# Altium project DMD_Card.PrjPcb
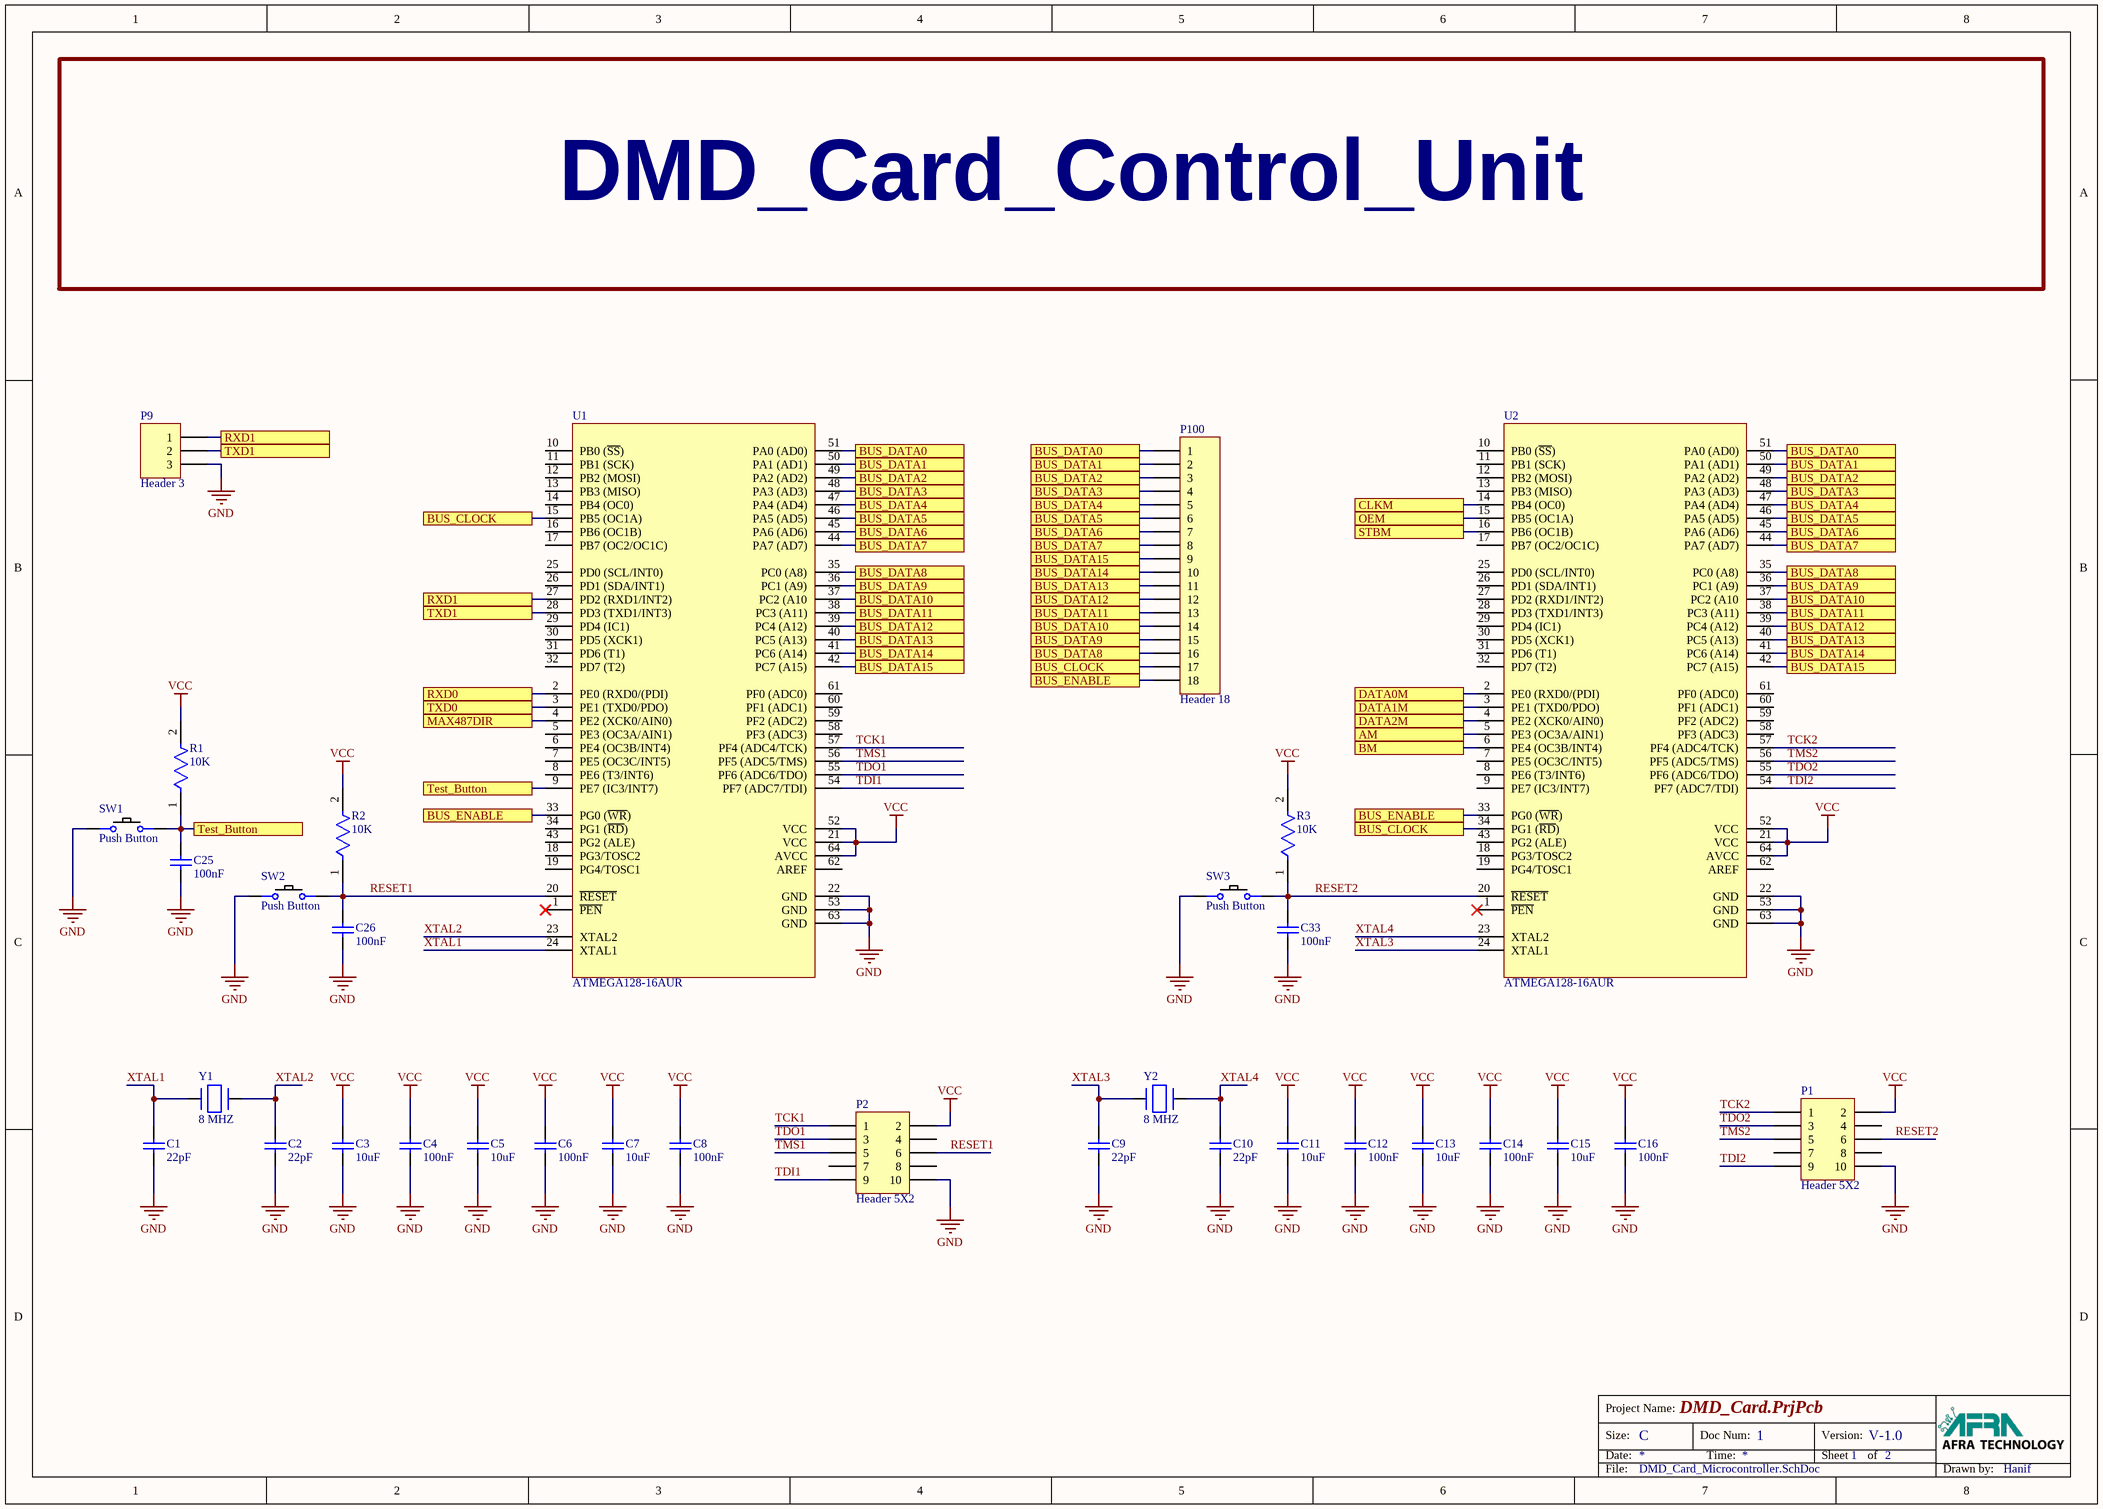
[diagram p0: DMD_Card_Microcontroller.SchDoc]
Project_Version: V-1.0
2 sheets, 64 parts. Net scope: flat (ports and power ports of the same name join across sheets).
Board file: DMD_Card.PcbDoc
Sheets:
  DMD_Card_Microcontroller.SchDoc
  DMD_Card_Modules.SchDoc

## Sheet DMD_Card_Microcontroller.SchDoc
size A3; DrawnBy: Hanif; Organization: AFRA Technology; DocumentNumber: 1; SheetNumber: 1; SheetTotal: 2

### Parts
C1  22pF  [Yageo_CC1206-1.25_IPC_A]
C2  22pF  [Yageo_CC1206-1.25_IPC_A]
C3  10uF  [Yageo_CC1206-1.25_IPC_A]
C4  100nF  [Yageo_CC1206-1.25_IPC_A]
C5  10uF  [Yageo_CC1206-1.25_IPC_A]
C6  100nF  [Yageo_CC1206-1.25_IPC_A]
C7  10uF  [Yageo_CC1206-1.25_IPC_A]
C8  100nF  [Yageo_CC1206-1.25_IPC_A]
C9  22pF  [Yageo_CC1206-1.25_IPC_A]
C10  22pF  [Yageo_CC1206-1.25_IPC_A]
C11  10uF  [Yageo_CC1206-1.25_IPC_A]
C12  100nF  [Yageo_CC1206-1.25_IPC_A]
C13  10uF  [Yageo_CC1206-1.25_IPC_A]
C14  100nF  [Yageo_CC1206-1.25_IPC_A]
C15  10uF  [Yageo_CC1206-1.25_IPC_A]
C16  100nF  [Yageo_CC1206-1.25_IPC_A]
C25  100nF  [Yageo_CC1206-1.25_IPC_A]
C26  100nF  [Yageo_CC1206-1.25_IPC_A]
C33  100nF  [Yageo_CC1206-1.25_IPC_A]
P1  Header 5X2  [HDR2X5]
P2  Header 5X2  [HDR2X5]
P9  Header 3  [HDR1X3]
P100  Header 18  [HDR1X18]
R1  10K  [Yageo_RT1206_IPC_A]
R2  10K  [Yageo_RT1206_IPC_A]
R3  10K  [Yageo_RT1206_IPC_A]
SW1  Push Button  [Tactile Switch SPST]
SW2  Push Button  [Tactile Switch SPST]
SW3  Push Button  [Tactile Switch SPST]
U1  ATMEGA128-16AUR  [64-TQFP]
U2  ATMEGA128-16AUR  [64-TQFP]
Y1  8 MHZ  [CTS_ATS080B_0]
Y2  8 MHZ  [CTS_ATS080B_0]

### Ports
AM, BM, BUS_CLOCK, BUS_DATA0, BUS_DATA1, BUS_DATA2, BUS_DATA3, BUS_DATA4, BUS_DATA5, BUS_DATA6, BUS_DATA7, BUS_DATA8, BUS_DATA9, BUS_DATA10, BUS_DATA11, BUS_DATA12, BUS_DATA13, BUS_DATA14, BUS_DATA15, BUS_ENABLE, CLKM, DATA0M, DATA1M, DATA2M, MAX487DIR, OEM, RXD0, RXD1, STBM, Test_Button, TXD0, TXD1

### Nets
GND: C1.1 C2.1 C3.1 C4.1 C5.1 C6.1 C7.1 C8.1 C9.1 C10.1 C11.1 C12.1 C13.1 C14.1 C15.1 C16.1 C25.1 C26.1 C33.1 P1.10 P2.10 P9.3 SW1.1,2 SW2.1,2 SW3.1,2 U1.22(GND) U1.53(GND) U1.63(GND) U2.22(GND) U2.53(GND) U2.63(GND)
VCC: C3.2 C4.2 C5.2 C6.2 C7.2 C8.2 C11.2 C12.2 C13.2 C14.2 C15.2 C16.2 P1.2 P2.2 R1.2 R2.2 R3.2 U1.21(VCC) U1.52(VCC) U1.64(AVCC) U2.21(VCC) U2.52(VCC) U2.64(AVCC)
RESET1: C26.2 P2.6 R2.1 SW2.3,4 U1.20(~{RESET})
RESET2: C33.2 P1.6 R3.1 SW3.3,4 U2.20(~{RESET})
TCK1: P2.1 U1.57(PF4_(ADC4/TCK))
TCK2: P1.1 U2.57(PF4_(ADC4/TCK))
TDI1: P2.9 U1.54(PF7_(ADC7/TDI))
TDI2: P1.9 U2.54(PF7_(ADC7/TDI))
TDO1: P2.3 U1.55(PF6_(ADC6/TDO))
TDO2: P1.3 U2.55(PF6_(ADC6/TDO))
TMS1: P2.5 U1.56(PF5_(ADC5/TMS))
TMS2: P1.5 U2.56(PF5_(ADC5/TMS))
XTAL1: C1.2 U1.24(XTAL1) Y1.1
XTAL2: C2.2 U1.23(XTAL2) Y1.2
XTAL3: C9.2 U2.24(XTAL1) Y2.1
XTAL4: C10.2 U2.23(XTAL2) Y2.2
NetC25_2: C25.2 R1.1 SW1.3,4 U1.9(PE7_(IC3/INT7)) ; port Test_Button
NetP9_1: P9.1 U1.27(PD2_(RXD1/INT2)) ; port RXD1
NetP9_2: P9.2 U1.28(PD3_(TXD1/INT3)) ; port TXD1
NetP100_1: P100.1 U1.51(PA0_(AD0)) U2.51(PA0_(AD0)) ; port BUS_DATA0
NetP100_2: P100.2 U1.50(PA1_(AD1)) U2.50(PA1_(AD1)) ; port BUS_DATA1
NetP100_3: P100.3 U1.49(PA2_(AD2)) U2.49(PA2_(AD2)) ; port BUS_DATA2
NetP100_4: P100.4 U1.48(PA3_(AD3)) U2.48(PA3_(AD3)) ; port BUS_DATA3
NetP100_5: P100.5 U1.47(PA4_(AD4)) U2.47(PA4_(AD4)) ; port BUS_DATA4
NetP100_6: P100.6 U1.46(PA5_(AD5)) U2.46(PA5_(AD5)) ; port BUS_DATA5
NetP100_7: P100.7 U1.45(PA6_(AD6)) U2.45(PA6_(AD6)) ; port BUS_DATA6
NetP100_8: P100.8 U1.44(PA7_(AD7)) U2.44(PA7_(AD7)) ; port BUS_DATA7
NetP100_9: P100.9 U1.42(PC7_(A15)) U2.42(PC7_(A15)) ; port BUS_DATA15
NetP100_10: P100.10 U1.41(PC6_(A14)) U2.41(PC6_(A14)) ; port BUS_DATA14
NetP100_11: P100.11 U1.40(PC5_(A13)) U2.40(PC5_(A13)) ; port BUS_DATA13
NetP100_12: P100.12 U1.39(PC4_(A12)) U2.39(PC4_(A12)) ; port BUS_DATA12
NetP100_13: P100.13 U1.38(PC3_(A11)) U2.38(PC3_(A11)) ; port BUS_DATA11
NetP100_14: P100.14 U1.37(PC2_(A10) U2.37(PC2_(A10) ; port BUS_DATA10
NetP100_15: P100.15 U1.36(PC1_(A9)) U2.36(PC1_(A9)) ; port BUS_DATA9
NetP100_16: P100.16 U1.35(PC0_(A8)) U2.35(PC0_(A8)) ; port BUS_DATA8
NetP100_17: P100.17 U1.15(PB5_(OC1A)) U2.34(PG1_(~{RD})) ; port BUS_CLOCK
NetP100_18: P100.18 U1.33(PG0_(~{WR})) U2.33(PG0_(~{WR})) ; port BUS_ENABLE
NetU1_2: U1.2(PE0_(RXD0/(PDI)) ; port RXD0
NetU1_3: U1.3(PE1_(TXD0/PDO)) ; port TXD0
NetU1_4: U1.4(PE2_(XCK0/AIN0)) ; port MAX487DIR
NetU2_2: U2.2(PE0_(RXD0/(PDI)) ; port DATA0M
NetU2_3: U2.3(PE1_(TXD0/PDO)) ; port DATA1M
NetU2_4: U2.4(PE2_(XCK0/AIN0)) ; port DATA2M
NetU2_5: U2.5(PE3_(OC3A/AIN1)) ; port AM
NetU2_6: U2.6(PE4_(OC3B/INT4)) ; port BM
NetU2_14: U2.14(PB4_(OC0)) ; port CLKM
NetU2_15: U2.15(PB5_(OC1A)) ; port OEM
NetU2_16: U2.16(PB6_(OC1B)) ; port STBM

Not connected (* = marked no-connect by the designer): P1 4 7 8; P2 4 7 8; U1 1(~{PEN})* 5(PE3_(OC3A/AIN1)) 6(PE4_(OC3B/INT4)) 7(PE5_(OC3C/INT5)) 8(PE6_(T3/INT6)) 10(PB0_(~{SS})) 11(PB1_(SCK)) 12(PB2_(MOSI)) 13(PB3_(MISO)) 14(PB4_(OC0)) 16(PB6_(OC1B)) 17(PB7_(OC2/OC1C)) 18(PG3/TOSC2) 19(PG4/TOSC1) 25(PD0_(SCL/INT0)) 26(PD1_(SDA/INT1)) 29(PD4_(IC1)) 30(PD5_(XCK1)) 31(PD6_(T1)) 32(PD7_(T2)) 34(PG1_(~{RD})) 43(PG2_(ALE)) 58(PF3_(ADC3)) 59(PF2_(ADC2)) 60(PF1_(ADC1)) 61(PF0_(ADC0)) 62(AREF); U2 1(~{PEN})* 7(PE5_(OC3C/INT5)) 8(PE6_(T3/INT6)) 9(PE7_(IC3/INT7)) 10(PB0_(~{SS})) 11(PB1_(SCK)) 12(PB2_(MOSI)) 13(PB3_(MISO)) 17(PB7_(OC2/OC1C)) 18(PG3/TOSC2) 19(PG4/TOSC1) 25(PD0_(SCL/INT0)) 26(PD1_(SDA/INT1)) 27(PD2_(RXD1/INT2)) 28(PD3_(TXD1/INT3)) 29(PD4_(IC1)) 30(PD5_(XCK1)) 31(PD6_(T1)) 32(PD7_(T2)) 43(PG2_(ALE)) 58(PF3_(ADC3)) 59(PF2_(ADC2)) 60(PF1_(ADC1)) 61(PF0_(ADC0)) 62(AREF)

### Notes on the sheet
- DMD_Card_Control_Unit
- Project Name:
- Size:
- Date:
- C
- Doc Num:
- Time:
- Version:
- Sheet
- of
- File:
- Drawn by:

### Library data of the parts
C1 C2 C9 C10 = CC1206JRNP09BN220: CAP 22pF 50V ±5% 1206 (3216 Metric) Thickness 0.75mm SMD; Tolerance: Â±5%; Case-Metric: 3216; Case-EIA: 1206; Max Thickness: 0.75 mm; Rated Voltage: 50 V; Value: 22pF; Technology: SMT; PartNumber: CC1206JRNP09BN220
C3 C5 C7 C11 C13 C15 = CC1206KRX7R7BB334
C4 C6 C8 C12 C14 C16 C25 C26 C33 = CC1206KRX7R7BB104
P1 P2 = Header 5X2: Header, 5-Pin, Dual row; LatestRevisionDate: 17-Jul-2002; LatestRevisionNote: Re-released for DXP Platform.; Publisher: Altium Limited
P9 = Header 3: Header, 3-Pin; LatestRevisionDate: 17-Jul-2002; LatestRevisionNote: Re-released for DXP Platform.; Publisher: Altium Limited
P100 = Header 18: Header, 18-Pin; LatestRevisionDate: 17-Jul-2002; LatestRevisionNote: Re-released for DXP Platform.; Publisher: Altium Limited
R1-R3 = RT1206BRD0710KL
SW1-SW3 = PTS526SKG15SMTR2LFS: Switch Tactile N.O. SPST Round Button Gull Wing 0.05A 12VDC 200000Cycles 2.45N SMD T/R; Manufacturer: ITT C&K; Supplier 1: Digi-Key; Manufacturer Part Number: PTS526SKG15SMTR2LFS; RoHS: No; Category: Tactile Switches; Stock 1: 7554; Pricing 1: 1=0.13000, 10=0.12100, 25=0.11480, 100=0.10430, 250=0.09808, 500=0.08972, 1000=0.07511 (USD); Supplier Part Number 1: CKN12223-1-ND
U1 U2 = ATMEGA128-16AUR: 8-bit AVR Microcontroller, 4.5-5.5V, 128KB Flash, 4KB EEPROM, 4KB SRAM, 64-pin TQFP, Industrial Grade (-40°C to 85°C), Reel; ComponentLink1Description: Manufacturer URL; ComponentLink2Description: ATmega128(L) Datasheet; DatasheetVersion: revX, Jun-2011; ComponentLink3URL: http://www.atmel.com/dyn/resources/prod_documents/2467S.pdf; ComponentLink3Description: ATmega128(L) Summary; ComponentLink1URL: http://www.atmel.com/; Code_JEDEC: MS-026-AEB; PackageVersion: revC, Oct-2010; PackageDescription: 64-Pin Plastic Thin Profile Quad Flat Pack, 14 x 14 x 1.0 mm Body, 0.8 mm Pitch (TQFP); ComponentLink2URL: http://www.atmel.com/dyn/resources/prod_documents/doc2467.pdf; PackageReference: 64A; PartNumber: ATMEGA128-16AUR
Y1 Y2 = CRYSTAL 8.000MHZ: CRYSTAL 8.000MHZ 20PF THRU; Manufacturer: TXC; Manufacturer Part Number: 9B-8.000MBBK-B; Frequency Stability: 50ppm; Frequency: 8MHz; ESR (Equivalent Series Resistance): 80R; Supplier 1: Digi-Key; RoHS: Yes; Category: Crystals; Pricing 1: 1000=0.16000 (USD); Mount: Through Hole; Case/Package: Metal; Min Operating Temperature: -20°C; Max Operating Temperature: 70°C; Package Quantity: 1000; Frequency Tolerance: 50ppm; Load Capacitance: 20pF; Packaging: Bulk; Length: 0.453inch; Width: 0.197inch; Height: 0.145inch; ComponentLink1URL: https://datasheet.ciiva.com/6733/9b-6733750.pdf?src-supplier=Digi-Key; ComponentLink1Description: https://datasheet.ciiva.com/6733/9b-6733750.pdf?src-supplier=Digi-Key; ComponentLink2URL: https://datasheet.ciiva.com/29631/9b-29631174.pdf?src-supplier=Digi-Key; ComponentLink2Description: https://datasheet.ciiva.com/29631/9b-29631174.pdf?src-supplier=Digi-Key; Supplier Part Number 1: 887-2033-ND

## Sheet DMD_Card_Modules.SchDoc
size A3; DrawnBy: Hanif; Organization: AFRA Technology; DocumentNumber: 2; SheetNumber: 2; SheetTotal: 2
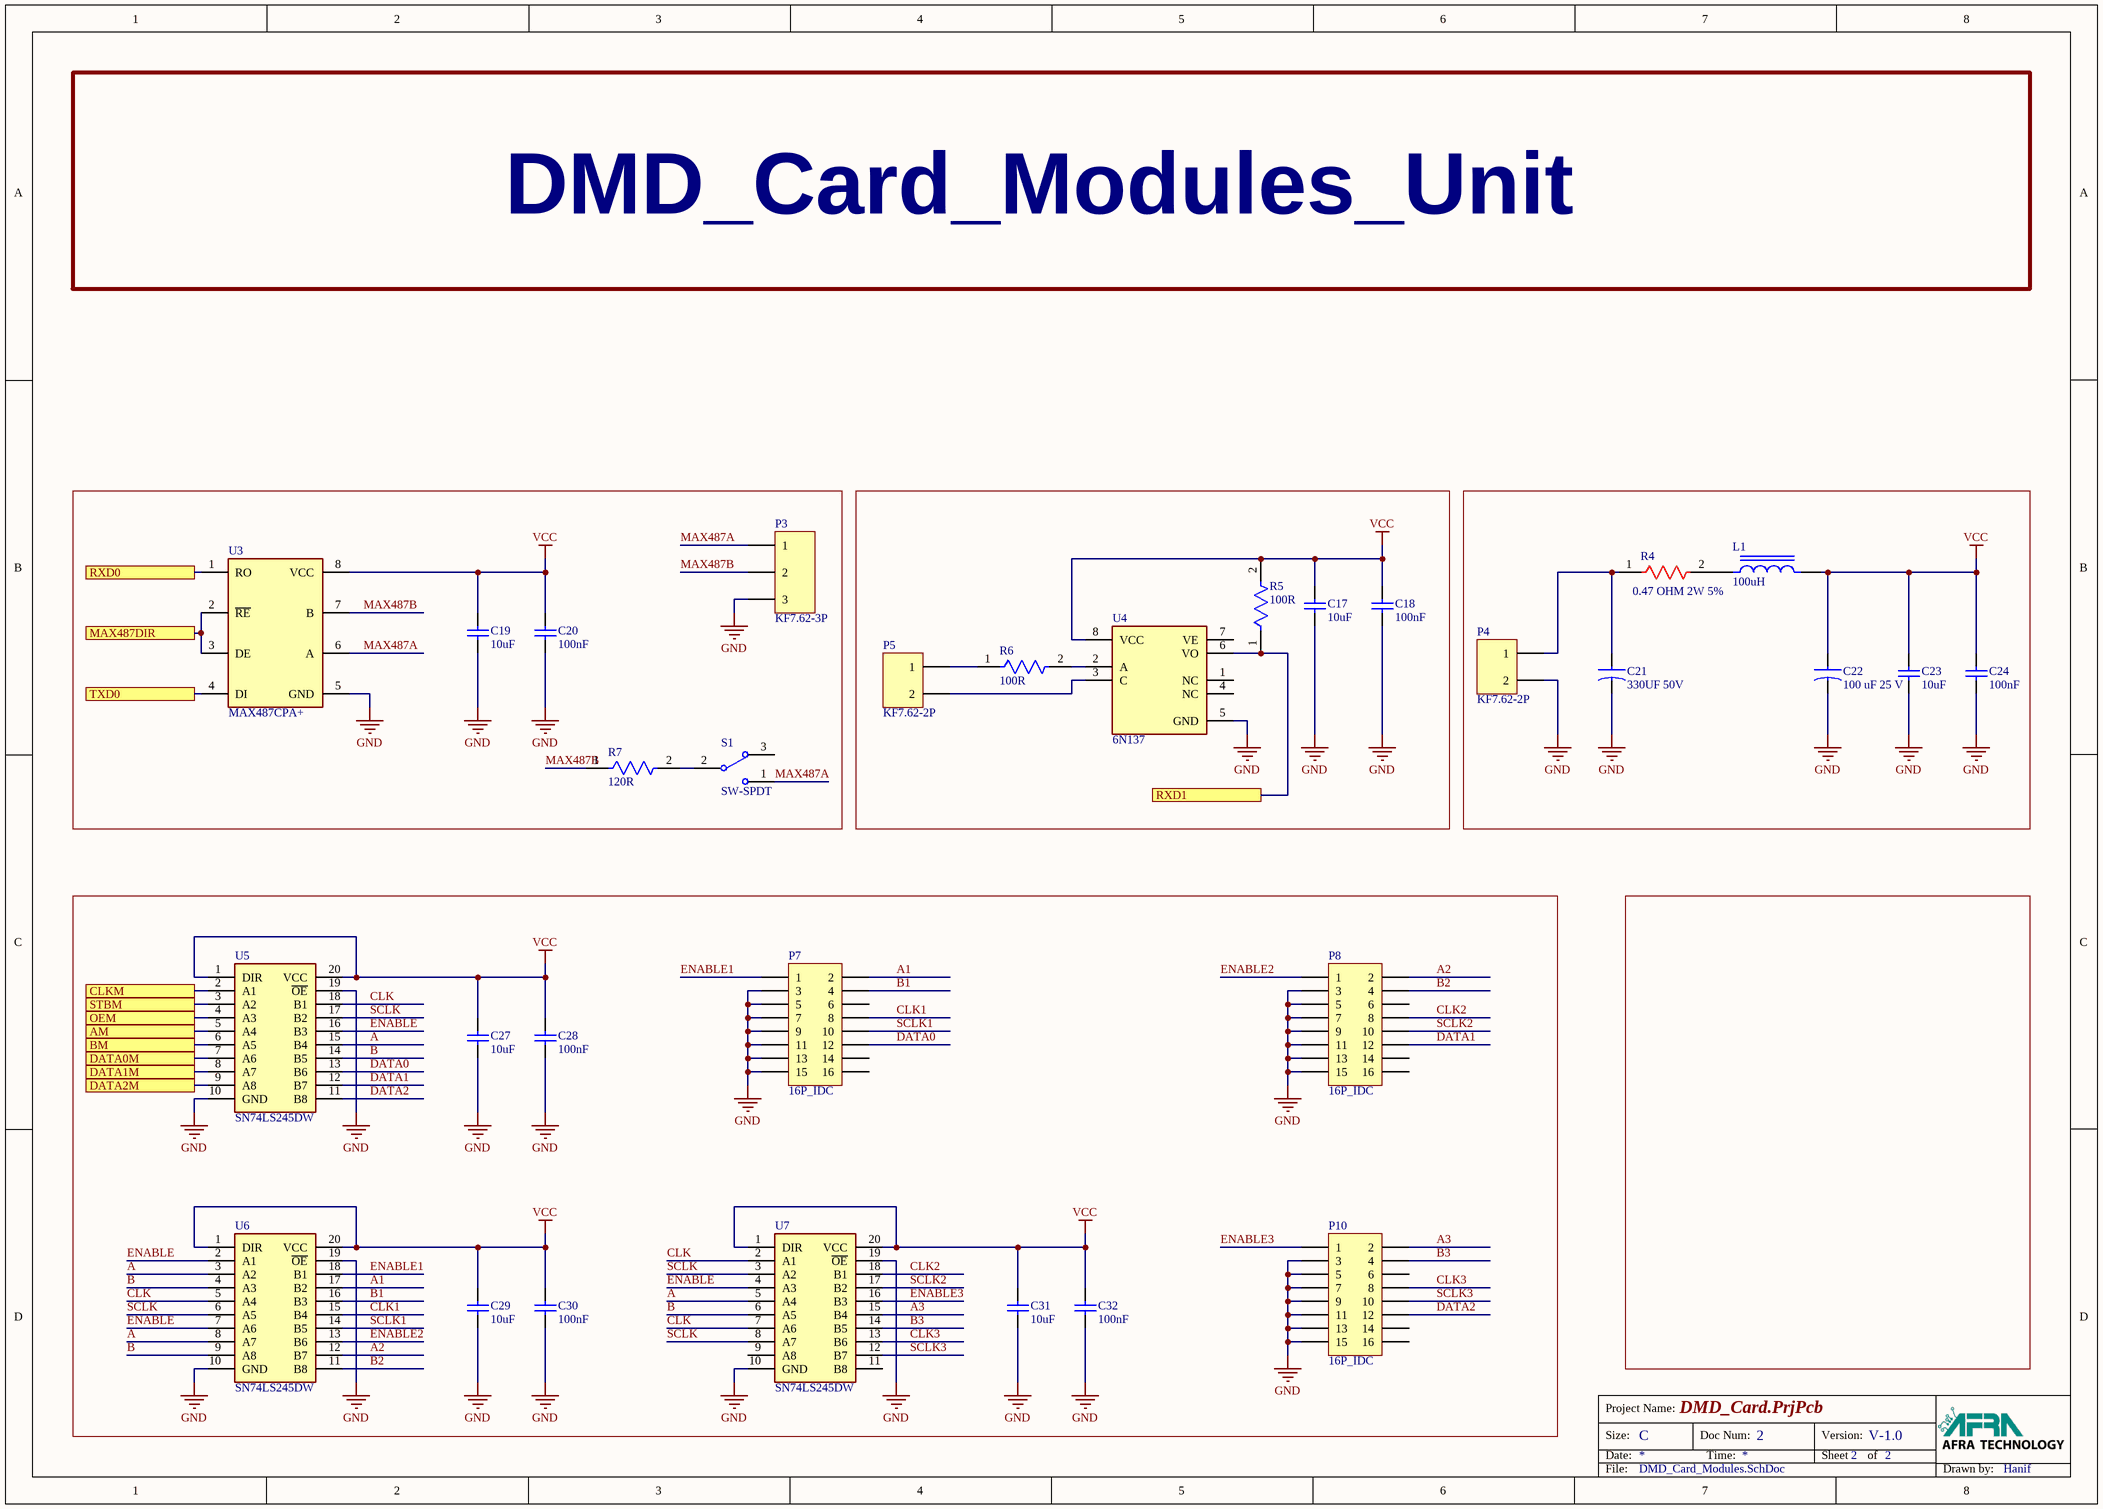
[diagram p1: DMD_Card_Modules.SchDoc]

### Parts
C17  10uF  [Yageo_CC1206-1.25_IPC_A]
C18  100nF  [Yageo_CC1206-1.25_IPC_A]
C19  10uF  [Yageo_CC1206-1.25_IPC_A]
C20  100nF  [Yageo_CC1206-1.25_IPC_A]
C21  330UF 50V  [Multy_Radial_Capacitor]
C22  100 uF 25 V  [Multy_Radial_Capacitor]
C23  10uF  [Yageo_CC1206-1.25_IPC_A]
C24  100nF  [Yageo_CC1206-1.25_IPC_A]
C27  10uF  [Yageo_CC1206-1.25_IPC_A]
C28  100nF  [Yageo_CC1206-1.25_IPC_A]
C29  10uF  [Yageo_CC1206-1.25_IPC_A]
C30  100nF  [Yageo_CC1206-1.25_IPC_A]
C31  10uF  [Yageo_CC1206-1.25_IPC_A]
C32  100nF  [Yageo_CC1206-1.25_IPC_A]
L1  100uH  [Radia_03]
P3  KF7.62-3P  [KF7.62-3P Barrier Terminal Block]
P4  KF7.62-2P  [KF7.62-2P Barrier Terminal Block]
P5  KF7.62-2P  [KF7.62-2P Barrier Terminal Block]
P7  16P_IDC  [16Pin_IDC_Connector]
P8  16P_IDC  [16Pin_IDC_Connector]
P10  16P_IDC  [16Pin_IDC_Connector]
R4  0.47 OHM 2W 5%  [Axial 0.6]
R5  100R  [Yageo_RT1206_IPC_A]
R6  100R  [Yageo_RT1206_IPC_A]
R7  120R  [AXIAL 0.4]
S1  SW-SPDT  [Toggle Switch_SPDT]
U3  MAX487CPA+  [DIP_08]
U4  Part Number: 6N137  [DIP_08]  (hidden comment: IC_Vishay_6N137_eec)
U5  SN74LS245DW  [SOIC127P1030X265-20N]
U6  SN74LS245DW  [SOIC127P1030X265-20N]
U7  SN74LS245DW  [SOIC127P1030X265-20N]

### Ports
AM, BM, CLKM, DATA0M, DATA1M, DATA2M, MAX487DIR, OEM, RXD0, RXD1, STBM, TXD0

### Nets
GND: C17.1 C18.1 C19.1 C20.1 C21.2 C22.2 C23.1 C24.1 C27.1 C28.1 C29.1 C30.1 C31.1 C32.1 P3.3 P4.2 P7.3 P7.5 P7.7 P7.9 P7.11 P7.13 P7.15 P8.3 P8.5 P8.7 P8.9 P8.11 P8.13 P8.15 P10.3 P10.5 P10.7 P10.9 P10.11 P10.13 P10.15 U3.5(GND) U4.5(GND) U5.10(GND) U5.19(~{OE}) U6.10(GND) U6.19(~{OE}) U7.10(GND) U7.19(~{OE})
VCC: C17.2 C18.2 C19.2 C20.2 C22.1 C23.2 C24.2 C27.2 C28.2 C29.2 C30.2 C31.2 C32.2 L1.2 R5.2 U3.8(VCC) U4.8(VCC) U5.1(DIR) U5.20(VCC) U6.1(DIR) U6.20(VCC) U7.1(DIR) U7.20(VCC)
A: U5.15(B4) U6.3(A2) U6.8(A7) U7.5(A4)
A1: P7.2 U6.17(B2)
A2: P8.2 U6.12(B7)
A3: P10.2 U7.15(B4)
B: U5.14(B5) U6.4(A3) U6.9(A8) U7.6(A5)
B1: P7.4 U6.16(B3)
B2: P8.4 U6.11(B8)
B3: P10.4 U7.14(B5)
CLK: U5.18(B1) U6.5(A4) U7.2(A1) U7.7(A6)
CLK1: P7.8 U6.15(B4)
CLK2: P8.8 U7.18(B1)
CLK3: P10.8 U7.13(B6)
DATA0: P7.12 U5.13(B6)
DATA1: P8.12 U5.12(B7)
DATA2: P10.12 U5.11(B8)
ENABLE: U5.16(B3) U6.2(A1) U6.7(A6) U7.4(A3)
ENABLE1: P7.1 U6.18(B1)
ENABLE2: P8.1 U6.13(B6)
ENABLE3: P10.1 U7.16(B3)
MAX487A: P3.1 S1.1 U3.6(A)
MAX487B: P3.2 R7.1 U3.7(B)
SCLK: U5.17(B2) U6.6(A5) U7.3(A2) U7.8(A7)
SCLK1: P7.10 U6.14(B5)
SCLK2: P8.10 U7.17(B2)
SCLK3: P10.10 U7.12(B7)
NetC21_1: C21.1 P4.1 R4.1
NetL1_1: L1.1 R4.2
NetP5_1: P5.1 R6.1
NetP5_2: P5.2 U4.3(C)
NetP9_1: R5.1 U4.6(VO) ; port RXD1
NetR6_2: R6.2 U4.2(A)
NetR7_2: R7.2 S1.2
NetU1_2: U3.1(RO) ; port RXD0
NetU1_3: U3.4(DI) ; port TXD0
NetU1_4: U3.2(~{RE}) U3.3(DE) ; port MAX487DIR
NetU2_2: U5.7(A6) ; port DATA0M
NetU2_3: U5.8(A7) ; port DATA1M
NetU2_4: U5.9(A8) ; port DATA2M
NetU2_5: U5.5(A4) ; port AM
NetU2_6: U5.6(A5) ; port BM
NetU2_14: U5.2(A1) ; port CLKM
NetU2_15: U5.4(A3) ; port OEM
NetU2_16: U5.3(A2) ; port STBM

Not connected (* = marked no-connect by the designer): P7 6 14 16; P8 6 14 16; P10 6 14 16; S1 3; U4 1(NC) 4(NC) 7(VE); U7 9(A8) 11(B8)

### Notes on the sheet
- DMD_Card_Modules_Unit
- Project Name:
- Size:
- Date:
- C
- Doc Num:
- Time:
- Version:
- Sheet
- of
- File:
- Drawn by:

### Library data of the parts
C17 C19 C23 C27 C29 C31 = CC1206KRX7R7BB334
C18 C20 C24 C28 C30 C32 = CC1206KRX7R7BB104
C21 = 330 uF 50 V Electrolytic Capacitors: Aluminum Electrolytic Capacitors Radial, Can - 10000 Hrs @ 105°C; Manufacturer: Rubycon; Manufacturer Part Number: 50YXJ330M10X20; Tolerance: 20%; Ripple Current: 1.22A; Impedance: 60mR; Life (Hours): 10000Hour; Supplier 1: Digi-Key; RoHS: Yes; Category: Aluminum Electrolytic Capacitors; Stock 1: 72; Pricing 1: 1=0.82000, 10=0.57600, 50=0.43560, 100=0.37940, 500=0.28106, 1000=0.23890, 2500=0.22485, 5000=0.21080 (USD); Mount: Through Hole; Case/Package: Radial; Min Operating Temperature: -40°C; Max Operating Temperature: 105°C; Capacitance: 330uF; Termination: Radial; Package Quantity: 1000; Voltage Rating: 50V; Packaging: Bulk; Voltage Rating (DC): 50V; Series: YXJ; Diameter: 10mm; Height: 20mm; Lead Pitch: 5mm; Height - Seated (Max): 0.866inch; Radiation Hardening: No; REACH SVHC: No SVHC; RoHS Compliant: Yes; ComponentLink1URL: https://datasheet.ciiva.com/46371/1657883-46371898.pdf?src-supplier=Element14; ComponentLink1Description: https://datasheet.ciiva.com/46371/1657883-46371898.pdf?src-supplier=Element14; ComponentLink2URL: https://datasheet.ciiva.com/17513/e-yxj-17513675.pdf?src-supplier=Avnet+Europe; ComponentLink2Description: https://datasheet.ciiva.com/17513/e-yxj-17513675.pdf?src-supplier=Avnet+Europe; Supplier Part Number 1: 1189-1424-ND
C22 = 100 uF 25 V Electrolytic Capacitor: RZ Series Radial 25 V 100 uF Ø 6.3 x 11 mm 105 °C Electrolytic Capacitor; Manufacturer: Samwha; Manufacturer Part Number: RZ1E107M6L011BB280; Capacitance: 100uF; Voltage Rating: 25V; Supplier 1: Future Electronics; RoHS: Yes; Pricing 1: 3600=0.03300 (USD); Case/Package: Radial; Lead Free: Lead Free; ComponentLink1URL: http://www.samwha.com/electric/product/list_pdf2/RZ.pdf?src-supplier=Future+Electronics; ComponentLink1Description: http://www.samwha.com/electric/product/list_pdf2/RZ.pdf?src-supplier=Future+Electronics; Supplier Part Number 1: 1048642
L1 = RLB0812-101KL: FIXED IND 100UH 320MA 600 MOHM; Manufacturer: Bourns; Core Material: Ferrite; Tolerance: 10%; Self Resonant Frequency: 4.2MHz; Shielding: Unshielded; DC Resistance (DCR): 600mR; Q Factor: 45; Test Frequency: 796kHz; Lead/Base Style: Radial; Lead Diameter: 0.65mm; Supplier 1: Digi-Key; Manufacturer Part Number: RLB0812-101KL; RoHS: Yes; Category: Fixed Inductors; Stock 1: 1145; Pricing 1: 1=0.40000, 10=0.35200, 25=0.30800, 50=0.26400, 100=0.24200, 250=0.22000, 500=0.20680, 1000=0.15840, 2500=0.14960 (USD); Mount: Through Hole; Case/Package: Radial; Min Operating Temperature: -40°C; Max Operating Temperature: 105°C; Package Quantity: 400; Packaging: Bulk; Current Rating: 320mA; Inductance: 100uH; Max DC Current: 320mA; Termination: Radial; DC Current: 320mA; Series: RLB; Diameter: 6.7mm; Length: 10mm; Height: 0.394inch; Lead Pitch: 3mm; Radiation Hardening: No; Military Standard: Not; RoHS Compliant: Yes; ComponentLink1URL: https://datasheet.ciiva.com/1069/rlb-1069242.pdf?src-supplier=Digi-Key; ComponentLink1Description: https://datasheet.ciiva.com/1069/rlb-1069242.pdf?src-supplier=Digi-Key; ComponentLink2URL: https://datasheet.ciiva.com/4960/rlb-4960710.pdf?src-supplier=Mouser; ComponentLink2Description: https://datasheet.ciiva.com/4960/rlb-4960710.pdf?src-supplier=Mouser; ComponentLink3URL: https://datasheet.ciiva.com/8110/rlb-8110999.pdf?src-supplier=Avnet; ComponentLink3Description: https://datasheet.ciiva.com/8110/rlb-8110999.pdf?src-supplier=Avnet; Supplier Part Number 1: RLB0812-101KL-ND
P3 = KF7.62-3P Barrier Terminal Block: KF7.62-3P Barrier Terminal Block, 7.62mm spacing barrier terminals with side expandable slot. The terminal accepts wire gauge of 22~12AWG. Connectors are available black PA66 material.
P4 P5 = KF7.62-2P Barrier Terminal Block: KF7.62-2P Barrier Terminal Block, 7.62mm spacing barrier terminals with side expandable slot. The terminal accepts wire gauge of 22~12AWG. Connectors are available black PA66 material.
P7 P8 P10 = BHR-16-VUA: Headers & Wire Housings 16P STRAIGHT; Manufacturer: Adam Equipment; Current Rating: 1A; Number of Positions: 16; Pitch: 2.54mm; Supplier 1: Digi-Key; Manufacturer Part Number: BHR-16-VUA; RoHS: Yes; Category: Connectors; Stock 1: 804; Pricing 1: 1=0.45000, 10=0.42400, 100=0.29690, 500=0.25452, 1000=0.21210, 5000=0.18180, 10000=0.16968 (USD); Contact Plating: Gold; Contact Material: Brass; Package Quantity: 276; Number of Rows: 2; Packaging: Tray; Orientation: Straight; Termination: IDC; Lead Free: Lead Free; ComponentLink1URL: https://datasheet.ciiva.com/16418/page-319-321-16418937.pdf?src-supplier=Future+Electronics; ComponentLink1Description: https://datasheet.ciiva.com/16418/page-319-321-16418937.pdf?src-supplier=Future+Electronics; Supplier Part Number 1: 2057-BHR-16-VUA-ND
R4 = 2WD47: RESISTOR 2 WATT METAL OXIDE FILM FLAMEPROOF 0.47 OHM 5% AXIAL LEAD; Manufacturer: NTE Electronics; Resistance: 470mR; Temperature Coefficient: 200ppm/°C; Supplier 1: Newark; Manufacturer Part Number: 2WD47; RoHS: Yes; Category: Through-Hole Resistors; Pricing 1: 1=0.18800 (USD); Mount: Through Hole; Case/Package: Metal; Weight: 0.0024lb; Min Operating Temperature: -55°C; Max Operating Temperature: 200°C; Tolerance: 5%; Power Rating: 2W; Termination: Axial; Length: 3.25inch; Width: 0.25inch; Height: 0.25inch; RoHS Compliant: No; ComponentLink1URL: http://www.onlinecomponents.com/productFiles/mf-NTE/twow.pdf?src-supplier=Onlinecomponents.com; ComponentLink1Description: http://www.onlinecomponents.com/productFiles/mf-NTE/twow.pdf?src-supplier=Onlinecomponents.com; ComponentLink2URL: http://www.alliedelec.com/m/d/d44ce2bb19ec670cc5afc3c1f91c41cf.pdf?src-supplier=Allied+Electronics; ComponentLink2Description: http://www.alliedelec.com/m/d/d44ce2bb19ec670cc5afc3c1f91c41cf.pdf?src-supplier=Allied+Electronics; Supplier Part Number 1: 33C8349
R5 R6 = RT1206BRD07100RL
R7 = 120R 1/4W: RES 120 OHM 1/4W 0.1% AXIAL; Manufacturer: Yageo; Manufacturer Part Number: MFP-25BRD52-120R; Max Power Dissipation: 250mW; Temperature Coefficient: 25ppm/°C; Supplier 1: Digi-Key; RoHS: Yes; Category: Through-Hole Resistors; Stock 1: 4420; Pricing 1: 1=0.70000, 10=0.49900, 25=0.38960, 50=0.32960, 100=0.25970, 250=0.21972, 500=0.17978, 1000=0.13983 (USD); Case/Package: Axial; Min Operating Temperature: -55°C; Max Operating Temperature: 155°C; Package Quantity: 1; Resistance: 120R; Tolerance: 0.1%; Packaging: Tape and Reel; Resistor Type: Metal Film; Number of Terminations: 2; Series: MFP; Length: 0.248inch; Lead Free: Lead Free; RoHS Compliant: Yes; ComponentLink1URL: https://datasheet.ciiva.com/2713/yageolr-mfp-2013-2713048.pdf?src-supplier=Digi-Key; ComponentLink1Description: https://datasheet.ciiva.com/2713/yageolr-mfp-2013-2713048.pdf?src-supplier=Digi-Key; ComponentLink2URL: https://datasheet.ciiva.com/2713/yageolr-mfp-2013-2713049.pdf?src-supplier=Digi-Key; ComponentLink2Description: https://datasheet.ciiva.com/2713/yageolr-mfp-2013-2713049.pdf?src-supplier=Digi-Key; Supplier Part Number 1: 120ADCT-ND
S1 = SW-SPDT: SPDT Subminiature Toggle Switch, Right Angle Mounting, Vertical Actuation; Published: 24-Mar-1999; LatestRevisionDate: 17-Dec-2003; LatestRevisionNote: Schematic revised, PCB Footprint replaced.; DatasheetVersion: 05-Dec-2000; PackageReference: TL36WW15050; Publisher: Altium Limited; PackageDescription: Switch; 4 Leads; ComponentLink1Description: Manufacturer Link; ComponentLink1URL: http://www.apem.com
U3 = MAX487ECPA+: Interface IC RS422/485 DIL-8, MAX487ECPA+, Maxim; Operating Supply Voltage: 5V; Number of Transmitters: 1; Logic Function: Transceiver; Data Rate: 256Kbps; Max Power Dissipation: 727mW; Output Voltage: 3V; Propagation Delay: 250ns; Max Supply Voltage: 5.25V; Min Supply Voltage: 4.75V; Nominal Supply Current: 250uA; Interface: RS-422,RS-485; Simplex/Duplex: Half Duplex; Supplier 1: Digi-Key; Manufacturer: Maxim; Manufacturer Part Number: MAX487ECPA+; RoHS: Yes; Category: Interface ICs; Stock 1: 285; Pricing 1: 1=4.05000, 10=3.63500, 25=3.43680, 100=3.05500 (USD); Mount: Through Hole; Case/Package: DIP; Number of Pins: 8; Min Operating Temperature: 0°C; Max Operating Temperature: 70°C; Packaging: Rail/Tube; Package Quantity: 50; Number of Receivers: 1; Number of Transceivers: 1; Series: -; Number of Drivers: 1; Supply Current: 250uA; Length: 9.91mm; Width: 7.87mm; Height: 4.45mm; Radiation Hardening: No; Lead Free: Lead Free; RoHS Compliant: Yes; REACH SVHC: No SVHC; ComponentLink1URL: https://datasheet.ciiva.com/16973/0900766b8078aed8-16973392.pdf?src-supplier=Allied+Electronics; ComponentLink1Description: https://datasheet.ciiva.com/16973/0900766b8078aed8-16973392.pdf?src-supplier=Allied+Electronics; ComponentLink2URL: https://datasheet.ciiva.com/16640/max1487e-max491e-16640614.pdf?src-supplier=Avnet+Europe; ComponentLink2Description: https://datasheet.ciiva.com/16640/max1487e-max491e-16640614.pdf?src-supplier=Avnet+Europe; ComponentLink3URL: https://datasheet.ciiva.com/8075/3976-8075401.pdf?src-supplier=Element14; ComponentLink3Description: https://datasheet.ciiva.com/8075/3976-8075401.pdf?src-supplier=Element14; ComponentLink4URL: https://datasheet.ciiva.com/14430/max1487e-max491e-14430329.pdf?src-supplier=Avnet; ComponentLink4Description: https://datasheet.ciiva.com/14430/max1487e-max491e-14430329.pdf?src-supplier=Avnet; ComponentLink5URL: https://datasheet.ciiva.com/14152/jxmax481e-491e-e-14152719.pdf?src-supplier=Distrelec; ComponentLink5Description: https://datasheet.ciiva.com/14152/jxmax481e-491e-e-14152719.pdf?src-supplier=Distrelec; ComponentLink6URL: https://datasheet.ciiva.com/1713/max1487e-max491e-1713146.pdf?src-supplier=Digi-Key; ComponentLink6Description: https://datasheet.ciiva.com/1713/max1487e-max491e-1713146.pdf?src-supplier=Digi-Key; ComponentLink7URL: https://datasheet.ciiva.com/4785/max1487e-max491e-4785914.pdf?src-supplier=Mouser; ComponentLink7Description: https://datasheet.ciiva.com/4785/max1487e-max491e-4785914.pdf?src-supplier=Mouser; Supplier Part Number 1: MAX487ECPA+-ND
U4 = IC_Vishay_6N137_eec: IC OPTOISO 5.3KV 1CH OPN DRAIN 8DIP; Manufacturer: Vishay; helpURL: https://upverter.com/upn/revision/90ff24e5d1aaa85f/; ComponentLink2Description: Datasheet; Temperature: -40°C to +100°C; Package: DIP8; Supplier 2: Mouser; Price: 1.00620280459; Supplier 1: Digi-Key; ComponentLink1URL: https://upverter.com/upn/revision/90ff24e5d1aaa85f/; Supplier Part Number 2: 782-6N137; Supplier Part Number 1: 751-1262-5-ND; ComponentLink1Description: Upverter; ComponentLink2URL: http://www.vishay.com/docs/84732/6n137.pdf; RoHS: TRUE; Mouser Part Number: 782-6N137; Ipc Land Pattern Name: DIP762W50P254L1016H425Q8; Temperature Range High: +100°C; Digikey Description: IC OPTOISO 5.3KV 1CH OPN DRAIN 8DIP; Digikey Part Number: 751-1262-5-ND; Lead Free: yes; Temperature Range Low: -40°C
U5-U7 = SN74LS245DW: Integrated Circuit; Manufacturer_Name: Texas Instruments; Datasheet Link: http://www.ti.com/lit/gpn/sn74ls245; Height: 2.65mm; Manufacturer_Part_Number: SN74LS245DW; Mouser Part Number: 595-SN74LS245DW; Mouser Price/Stock: https://www.mouser.co.uk/ProductDetail/Texas-Instruments/SN74LS245DW/?qs=ZA235jQDfbpxKQZqDHbgmw%3D%3D; Arrow Part Number: SN74LS245DW; Arrow Price/Stock: https://www.arrow.com/en/products/sn74ls245dw/texas-instruments

## Nets that join several sheets
GND: DMD_Card_Microcontroller (31 pins), DMD_Card_Modules (45 pins)
VCC: DMD_Card_Microcontroller (23 pins), DMD_Card_Modules (23 pins)
NetP9_1: DMD_Card_Microcontroller (P9.1 U1.27), DMD_Card_Modules (R5.1 U4.6)
NetU1_2: DMD_Card_Microcontroller (U1.2), DMD_Card_Modules (U3.1)
NetU1_3: DMD_Card_Microcontroller (U1.3), DMD_Card_Modules (U3.4)
NetU1_4: DMD_Card_Microcontroller (U1.4), DMD_Card_Modules (U3.2 U3.3)
NetU2_2: DMD_Card_Microcontroller (U2.2), DMD_Card_Modules (U5.7)
NetU2_3: DMD_Card_Microcontroller (U2.3), DMD_Card_Modules (U5.8)
NetU2_4: DMD_Card_Microcontroller (U2.4), DMD_Card_Modules (U5.9)
NetU2_5: DMD_Card_Microcontroller (U2.5), DMD_Card_Modules (U5.5)
NetU2_6: DMD_Card_Microcontroller (U2.6), DMD_Card_Modules (U5.6)
NetU2_14: DMD_Card_Microcontroller (U2.14), DMD_Card_Modules (U5.2)
NetU2_15: DMD_Card_Microcontroller (U2.15), DMD_Card_Modules (U5.4)
NetU2_16: DMD_Card_Microcontroller (U2.16), DMD_Card_Modules (U5.3)